# Altium schematic sheet STM32.SchDoc: STM32
size A3; Author: Silvio Navaretti; CompanyName: ARDUINO; DrawnBy: Silvio Navaretti; Engineer: Silvio Navaretti; Organization: ARDUINO; SheetNumber: 12; SheetTotal: 51; RevAuthor: Silvio Navaretti
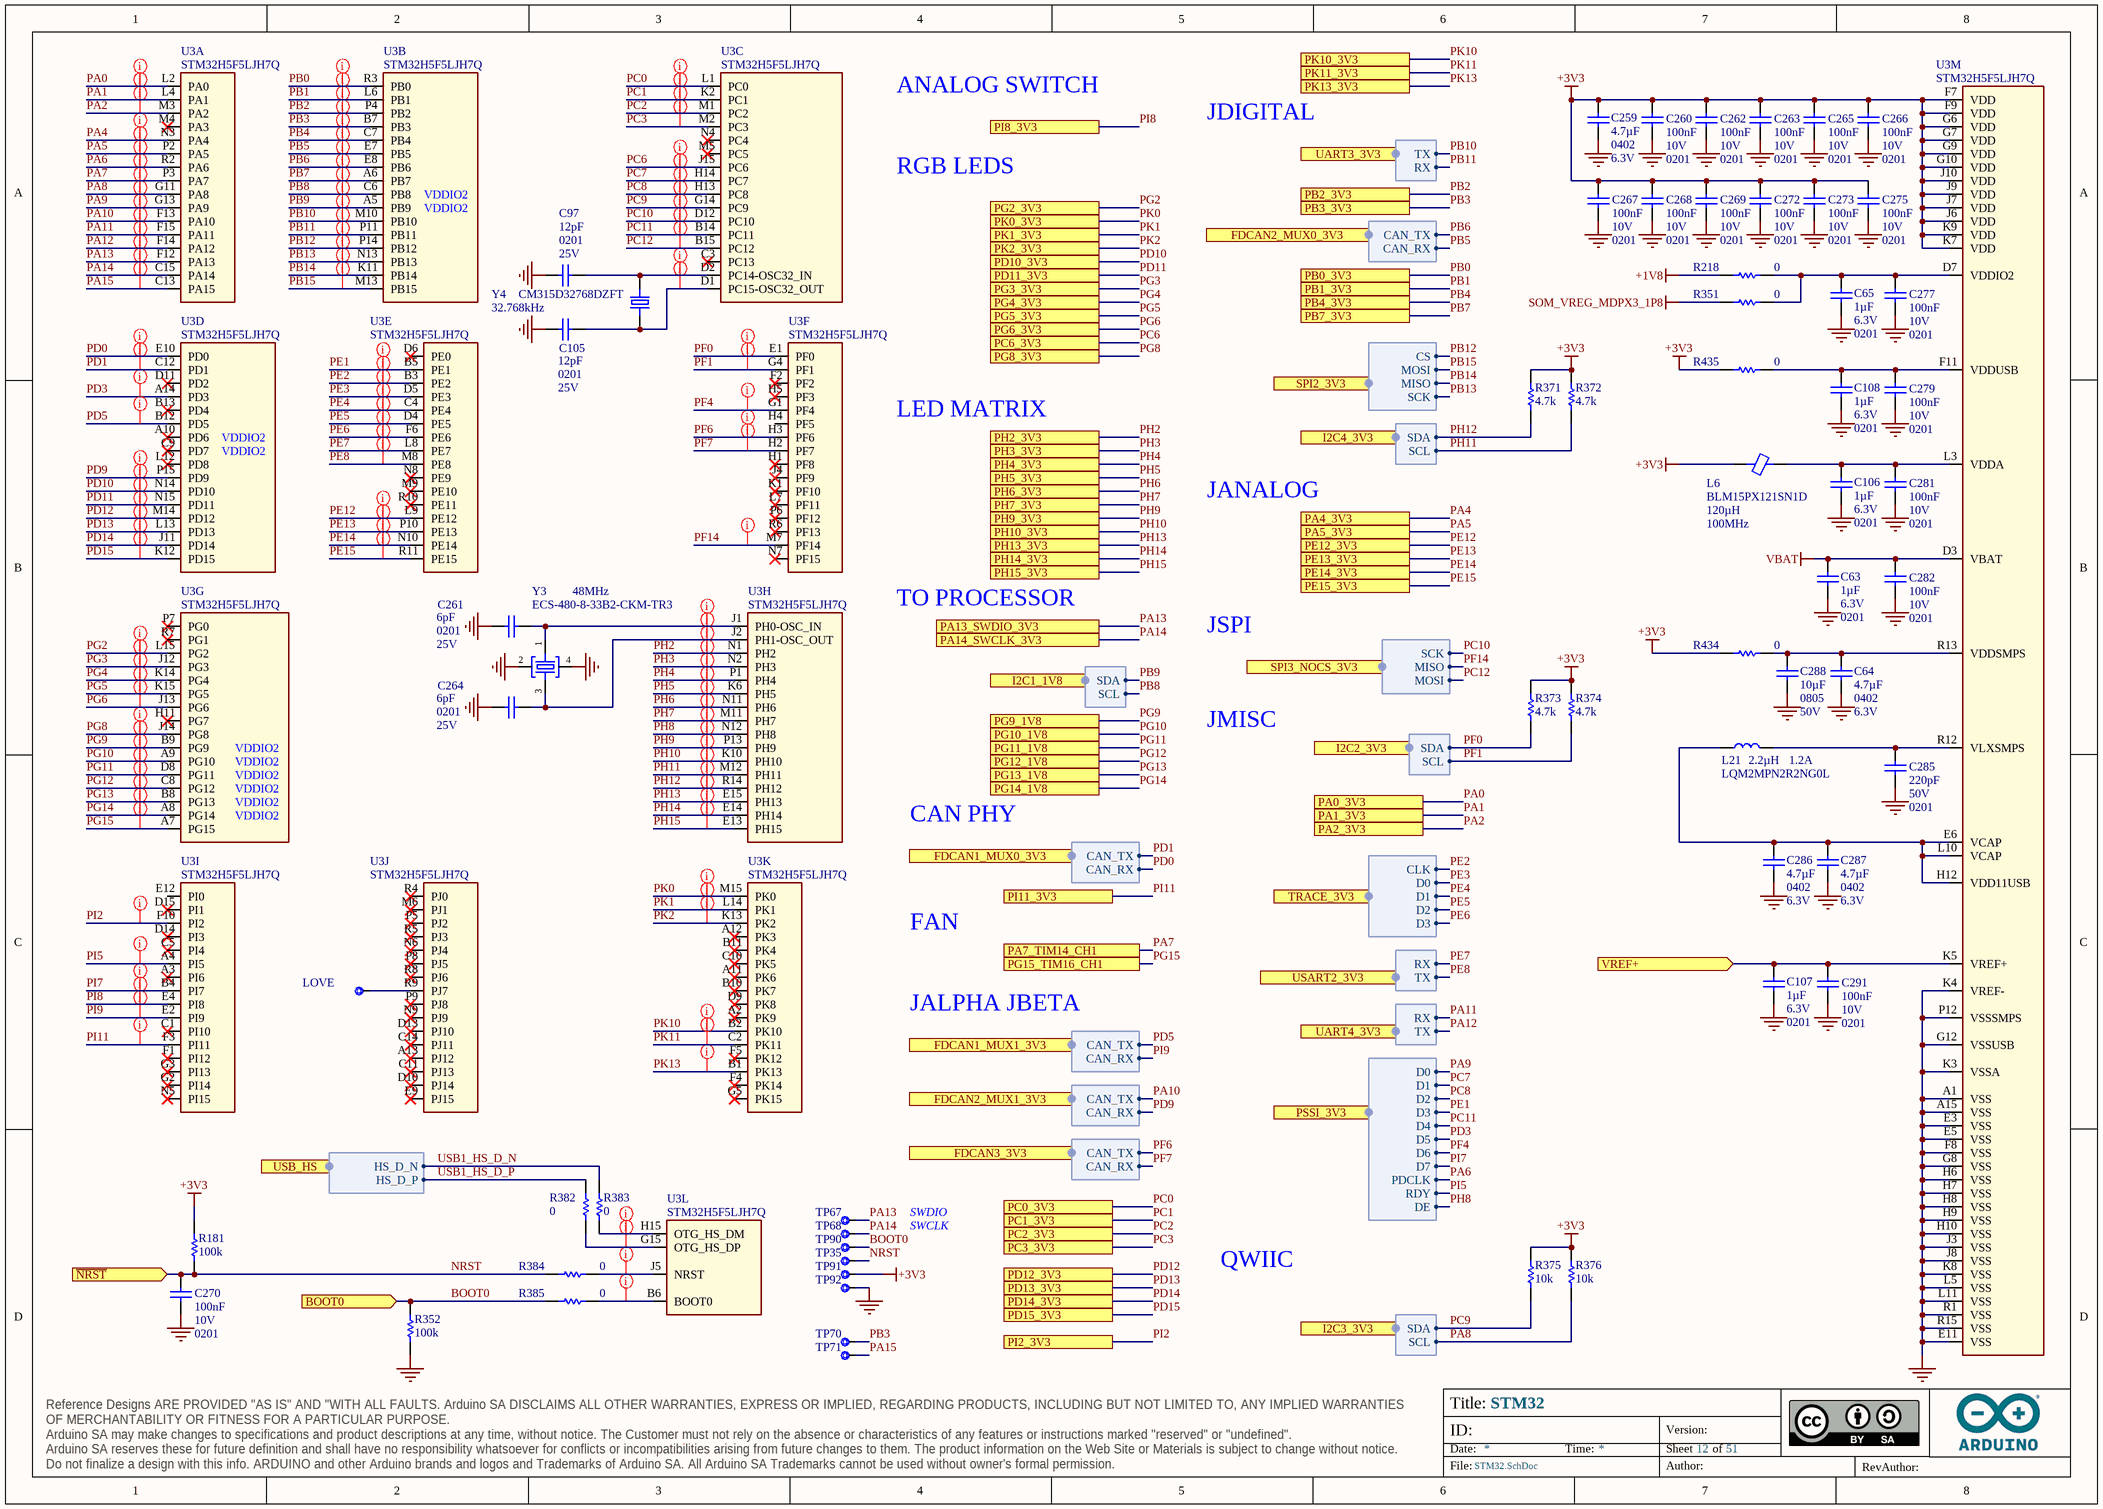
[diagram p0: STM32.SchDoc]

## Parts
C63  value 1µF  Voltage: 6.3V  Case Code (Imperial): 0201  [CAP-0201]  (hidden comment: GRM033R60J105MEA2D)
C64  value 4.7µF  Case Code (Imperial): 0402  Voltage: 6.3V  [CAP-0402]  (hidden comment: C1005A475M6R3NT)
C65  value 1µF  Voltage: 6.3V  Case Code (Imperial): 0201  [CAP-0201]  (hidden comment: GRM033R60J105MEA2D)
C97  value 12pF  Case Code (Imperial): 0201  Voltage: 25V  [CAP-0201]  (hidden comment: GRM0335C1E120JA01J)
C105  value 12pF  Case Code (Imperial): 0201  Voltage: 25V  [CAP-0201]  (hidden comment: GRM0335C1E120JA01J)
C106  value 1µF  Voltage: 6.3V  Case Code (Imperial): 0201  [CAP-0201]  (hidden comment: GRM033R60J105MEA2D)
C107  value 1µF  Voltage: 6.3V  Case Code (Imperial): 0201  [CAP-0201]  (hidden comment: GRM033R60J105MEA2D)
C108  value 1µF  Voltage: 6.3V  Case Code (Imperial): 0201  [CAP-0201]  (hidden comment: GRM033R60J105MEA2D)
C259  value 4.7µF  Case Code (Imperial): 0402  Voltage: 6.3V  [CAP-0402]  (hidden comment: C1005A475M6R3NT)
C260  value 100nF  Voltage: 10V  Case Code (Imperial): 0201  [CAP-0201]  (hidden comment: CL03A104KP3NNNC)
C261  value 6pF  Case Code (Imperial): 0201  Voltage: 25V  [CAP-0201]  (hidden comment: GRM0335C1E6R0CA01D)
C262  value 100nF  Voltage: 10V  Case Code (Imperial): 0201  [CAP-0201]  (hidden comment: CL03A104KP3NNNC)
C263  value 100nF  Voltage: 10V  Case Code (Imperial): 0201  [CAP-0201]  (hidden comment: CL03A104KP3NNNC)
C264  value 6pF  Case Code (Imperial): 0201  Voltage: 25V  [CAP-0201]  (hidden comment: GRM0335C1E6R0CA01D)
C265  value 100nF  Voltage: 10V  Case Code (Imperial): 0201  [CAP-0201]  (hidden comment: CL03A104KP3NNNC)
C266  value 100nF  Voltage: 10V  Case Code (Imperial): 0201  [CAP-0201]  (hidden comment: CL03A104KP3NNNC)
C267  value 100nF  Voltage: 10V  Case Code (Imperial): 0201  [CAP-0201]  (hidden comment: CL03A104KP3NNNC)
C268  value 100nF  Voltage: 10V  Case Code (Imperial): 0201  [CAP-0201]  (hidden comment: CL03A104KP3NNNC)
C269  value 100nF  Voltage: 10V  Case Code (Imperial): 0201  [CAP-0201]  (hidden comment: CL03A104KP3NNNC)
C270  value 100nF  Voltage: 10V  Case Code (Imperial): 0201  [CAP-0201]  (hidden comment: CL03A104KP3NNNC)
C272  value 100nF  Voltage: 10V  Case Code (Imperial): 0201  [CAP-0201]  (hidden comment: CL03A104KP3NNNC)
C273  value 100nF  Voltage: 10V  Case Code (Imperial): 0201  [CAP-0201]  (hidden comment: CL03A104KP3NNNC)
C275  value 100nF  Voltage: 10V  Case Code (Imperial): 0201  [CAP-0201]  (hidden comment: CL03A104KP3NNNC)
C277  value 100nF  Voltage: 10V  Case Code (Imperial): 0201  [CAP-0201]  (hidden comment: CL03A104KP3NNNC)
C279  value 100nF  Voltage: 10V  Case Code (Imperial): 0201  [CAP-0201]  (hidden comment: CL03A104KP3NNNC)
C281  value 100nF  Voltage: 10V  Case Code (Imperial): 0201  [CAP-0201]  (hidden comment: CL03A104KP3NNNC)
C282  value 100nF  Voltage: 10V  Case Code (Imperial): 0201  [CAP-0201]  (hidden comment: CL03A104KP3NNNC)
C285  value 220pF  Voltage: 50V  Case Code (Imperial): 0201  [CAP-0201]  (hidden comment: GRM033R71H221KA12D)
C286  value 4.7µF  Case Code (Imperial): 0402  Voltage: 6.3V  [CAP-0402]  (hidden comment: C1005A475M6R3NT)
C287  value 4.7µF  Case Code (Imperial): 0402  Voltage: 6.3V  [CAP-0402]  (hidden comment: C1005A475M6R3NT)
C288  value 10µF  Case Code (Imperial): 0805  Voltage: 50V  [CAP-0805]  (hidden comment: GRM21BR61H106ME43L)
C291  value 100nF  Voltage: 10V  Case Code (Imperial): 0201  [CAP-0201]  (hidden comment: CL03A104KP3NNNC)
L6  BLM15PX121SN1D  Inductance: 120µH  Test Frequency: 100MHz  [L-0402]
L21  LQM2MPN2R2NG0L  Current: 1.2A  Inductance: 2.2µH  [LQM2MPN2R2NG0L]
LOVE  Test point 1.00mm  [TP-1.00MM]  (value not drawn)  (no BOM)
R181  value 100k  [RES-0201]  (hidden comment: RC0201FR-07100KL)
R218  value 0  [RES-0201]  (hidden comment: CRCW02010000Z0ED)
R351  value 0  [RES-0201]  (hidden comment: CRCW02010000Z0ED)
R352  value 100k  [RES-0201]  (hidden comment: RC0201FR-07100KL)
R371  value 4.7k  [RES-0201]  (hidden comment: RC0201FR-074K7L)
R372  value 4.7k  [RES-0201]  (hidden comment: RC0201FR-074K7L)
R373  value 4.7k  [RES-0201]  (hidden comment: RC0201FR-074K7L)
R374  value 4.7k  [RES-0201]  (hidden comment: RC0201FR-074K7L)
R375  value 10k  [RES-0201]  (hidden comment: RC0201FR-0710KL)
R376  value 10k  [RES-0201]  (hidden comment: RC0201FR-0710KL)
R382  value 0  [RES-0201]  (hidden comment: CRCW02010000Z0ED)
R383  value 0  [RES-0201]  (hidden comment: CRCW02010000Z0ED)
R384  value 0  [RES-0201]  (hidden comment: CRCW02010000Z0ED)
R385  value 0  [RES-0201]  (hidden comment: CRCW02010000Z0ED)
R434  value 0  [RES-0201]  (hidden comment: CRCW02010000Z0ED)
R435  value 0  [RES-0201]  (hidden comment: CRCW02010000Z0ED)
TP35  Test point 1.00mm  [TP-1.00MM]  (value not drawn)  (no BOM)
TP67  Test point 1.00mm  [TP-1.00MM]  (value not drawn)  (no BOM)
TP68  Test point 1.00mm  [TP-1.00MM]  (value not drawn)  (no BOM)
TP70  Test point 1.00mm  [TP-1.00MM]  (value not drawn)  (no BOM)
TP71  Test point 1.00mm  [TP-1.00MM]  (value not drawn)  (no BOM)
TP90  Test point 1.00mm  [TP-1.00MM]  (value not drawn)  (no BOM)
TP91  Test point 1.00mm  [TP-1.00MM]  (value not drawn)  (no BOM)
TP92  Test point 1.00mm  [TP-1.00MM]  (value not drawn)  (no BOM)
U3  STM32H5F5LJH7Q  [BGA225C80P15X15_1300X1300X120]  (parts A,B,C,D,E,F,G,H,I,J,K,L,M of 13)
Y3  ECS-480-8-33B2-CKM-TR3  Frequency: 48MHz  [CRYSTAL3.2X2.5]
Y4  CM315D32768DZFT  Frequency: 32.768kHz  [ABS07]

## Ports
BOOT0 (in), FDCAN1_MUX0_3V3 (harness CAN), FDCAN1_MUX1_3V3 (harness CAN), FDCAN2_MUX0_3V3 (harness CAN), FDCAN2_MUX1_3V3 (harness CAN), FDCAN3_3V3 (harness CAN), I2C1_1V8 (harness I2C), I2C2_3V3 (harness I2C), I2C3_3V3 (harness I2C), I2C4_3V3 (harness I2C), PA0_3V3, PA1_3V3, PA2_3V3, PA4_3V3, PA5_3V3, PA7_TIM14_CH1, PA13_SWDIO_3V3, PA14_SWCLK_3V3, PB0_3V3, PB1_3V3, PB2_3V3, PB3_3V3, PB4_3V3, PB7_3V3, PC0_3V3, PC1_3V3, PC2_3V3, PC3_3V3, PC6_3V3, PD10_3V3, PD11_3V3, PD12_3V3, PD13_3V3, PD14_3V3, PD15_3V3, PE12_3V3, PE13_3V3, PE14_3V3, PE15_3V3, PG2_3V3, PG3_3V3, PG4_3V3, PG5_3V3, PG6_3V3, PG8_3V3, PG9_1V8, PG10_1V8, PG11_1V8, PG12_1V8, PG13_1V8, PG14_1V8, PG15_TIM16_CH1, PH2_3V3, PH3_3V3, PH4_3V3, PH5_3V3, PH6_3V3, PH7_3V3, PH9_3V3, PH10_3V3, PH13_3V3, PH14_3V3, PH15_3V3, PI2_3V3, PI8_3V3, PI11_3V3, PK0_3V3, PK1_3V3, PK2_3V3, PK10_3V3, PK11_3V3, PK13_3V3, PSSI_3V3 (harness PSSI), SPI2_3V3 (harness SPI), SPI3_NOCS_3V3 (harness JSPI_SPI), TRACE_3V3 (harness MCU_TRACE), UART3_3V3 (harness UART), UART4_3V3 (harness UART), USART2_3V3 (harness UART), USB_HS (harness SOM_MD_USB1), VREF+ (in), ~{NRST} (in)

## Harnesses
SPI: SCK, MISO, MOSI, CS
UART: TX, RX
I2C: SDA, SCL
CAN: CAN_TX, CAN_RX
PSSI: D0, D1, D2, D3, D4, D5, D6, D7, PDCLK, RDY, DE
JSPI_SPI: SCK, MISO, MOSI
MCU_TRACE: CLK, D0, D1, D2, D3
SOM_MD_USB1: HS_D_P, HS_D_N

## Nets
+1V8: R218.1
+3V3: C259.1 C260.2 C262.2 C263.2 C265.2 C266.2 C267.2 C268.2 C269.2 C272.2 C273.2 C275.2 L6.1 R181.2 R371.2 R372.2 R373.2 R374.2 R375.2 R376.2 R434.1 R435.1 TP91.X U3.F7(VDD) U3.F9(VDD) U3.G6(VDD) U3.G7(VDD) U3.G9(VDD) U3.G10(VDD) U3.J6(VDD) U3.J7(VDD) U3.J9(VDD) U3.J10(VDD) U3.K7(VDD) U3.K9(VDD)
GND: C63.1 C64.2 C65.1 C97.2 C105.2 C106.1 C107.1 C108.1 C259.2 C260.1 C261.2 C262.1 C263.1 C264.2 C265.1 C266.1 C267.1 C268.1 C269.1 C270.1 C272.1 C273.1 C275.1 C277.1 C279.1 C281.1 C282.1 C285.1 C286.2 C287.2 C288.2 C291.1 R352.1 TP92.X U3.A1(VSS) U3.A15(VSS) U3.E3(VSS) U3.E5(VSS) U3.E11(VSS) U3.F8(VSS) U3.G8(VSS) U3.G12(VSSUSB) U3.H6(VSS) U3.H7(VSS) U3.H8(VSS) U3.H9(VSS) U3.H10(VSS) U3.J3(VSS) U3.J8(VSS) U3.K3(VSSA) U3.K4(VREF-) U3.K8(VSS) U3.L5(VSS) U3.L11(VSS) U3.P12(VSSSMPS) U3.R1(VSS) U3.R15(VSS) Y3.2 Y3.4
SOM_VREG_MDPX3_1P8: R351.1
VBAT: C63.2 C282.2 U3.D3(VBAT)
BOOT0: R352.2 R385.1 TP90.X ; port BOOT0
NRST: C270.2 R181.1 R384.1 TP35.X ; port ~{NRST}
PA0: U3.L2(PA0) ; port PA0_3V3
PA1: U3.L4(PA1) ; port PA1_3V3
PA2: U3.M3(PA2) ; port PA2_3V3
PA4: U3.N3(PA4) ; port PA4_3V3
PA5: U3.P2(PA5) ; port PA5_3V3
PA6: U3.R2(PA6) ; port PSSI_3V3.PDCLK
PA7: U3.P3(PA7) ; port PA7_TIM14_CH1
PA8: R376.1 U3.G11(PA8) ; port I2C3_3V3.SCL
PA9: U3.G13(PA9) ; port PSSI_3V3.D0
PA10: U3.F13(PA10) ; port FDCAN2_MUX1_3V3.CAN_TX
PA11: U3.F15(PA11) ; port UART4_3V3.RX
PA12: U3.F14(PA12) ; port UART4_3V3.TX
PA13: TP67.X U3.F12(PA13) ; port PA13_SWDIO_3V3
PA14: TP68.X U3.C15(PA14) ; port PA14_SWCLK_3V3
PA15: TP71.X U3.C13(PA15)
PB0: U3.R3(PB0) ; port PB0_3V3
PB1: U3.L6(PB1) ; port PB1_3V3
PB2: U3.P4(PB2) ; port PB2_3V3
PB3: TP70.X U3.B7(PB3) ; port PB3_3V3
PB4: U3.C7(PB4) ; port PB4_3V3
PB5: U3.E7(PB5) ; port FDCAN2_MUX0_3V3.CAN_RX
PB6: U3.E8(PB6) ; port FDCAN2_MUX0_3V3.CAN_TX
PB7: U3.A6(PB7) ; port PB7_3V3
PB8: U3.C6(PB8) ; port I2C1_1V8.SCL
PB9: U3.A5(PB9) ; port I2C1_1V8.SDA
PB10: U3.M10(PB10) ; port UART3_3V3.TX
PB11: U3.P11(PB11) ; port UART3_3V3.RX
PB12: U3.P14(PB12) ; port SPI2_3V3.CS
PB13: U3.N13(PB13) ; port SPI2_3V3.SCK
PB14: U3.K11(PB14) ; port SPI2_3V3.MISO
PB15: U3.M13(PB15) ; port SPI2_3V3.MOSI
PC0: U3.L1(PC0) ; port PC0_3V3
PC1: U3.K2(PC1) ; port PC1_3V3
PC2: U3.M1(PC2) ; port PC2_3V3
PC3: U3.M2(PC3) ; port PC3_3V3
PC6: U3.J15(PC6) ; port PC6_3V3
PC7: U3.H14(PC7) ; port PSSI_3V3.D1
PC8: U3.H13(PC8) ; port PSSI_3V3.D2
PC9: R375.1 U3.G14(PC9) ; port I2C3_3V3.SDA
PC10: U3.D12(PC10) ; port SPI3_NOCS_3V3.SCK
PC11: U3.B14(PC11) ; port PSSI_3V3.D4
PC12: U3.B15(PC12) ; port SPI3_NOCS_3V3.MOSI
PD0: U3.E10(PD0) ; port FDCAN1_MUX0_3V3.CAN_RX
PD1: U3.C12(PD1) ; port FDCAN1_MUX0_3V3.CAN_TX
PD3: U3.A14(PD3) ; port PSSI_3V3.D5
PD5: U3.B12(PD5) ; port FDCAN1_MUX1_3V3.CAN_TX
PD9: U3.P15(PD9) ; port FDCAN2_MUX1_3V3.CAN_RX
PD10: U3.N14(PD10) ; port PD10_3V3
PD11: U3.N15(PD11) ; port PD11_3V3
PD12: U3.M14(PD12) ; port PD12_3V3
PD13: U3.L13(PD13) ; port PD13_3V3
PD14: U3.J11(PD14) ; port PD14_3V3
PD15: U3.K12(PD15) ; port PD15_3V3
PE1: U3.B5(PE1) ; port PSSI_3V3.D3
PE2: U3.B3(PE2) ; port TRACE_3V3.CLK
PE3: U3.D5(PE3) ; port TRACE_3V3.D0
PE4: U3.C4(PE4) ; port TRACE_3V3.D1
PE5: U3.D4(PE5) ; port TRACE_3V3.D2
PE6: U3.F6(PE6) ; port TRACE_3V3.D3
PE7: U3.L8(PE7) ; port USART2_3V3.RX
PE8: U3.M8(PE8) ; port USART2_3V3.TX
PE12: U3.L9(PE12) ; port PE12_3V3
PE13: U3.P10(PE13) ; port PE13_3V3
PE14: U3.N10(PE14) ; port PE14_3V3
PE15: U3.R11(PE15) ; port PE15_3V3
PF0: R373.1 U3.E1(PF0) ; port I2C2_3V3.SDA
PF1: R374.1 U3.G4(PF1) ; port I2C2_3V3.SCL
PF4: U3.G1(PF4) ; port PSSI_3V3.D6
PF6: U3.H3(PF6) ; port FDCAN3_3V3.CAN_TX
PF7: U3.H2(PF7) ; port FDCAN3_3V3.CAN_RX
PF14: U3.M7(PF14) ; port SPI3_NOCS_3V3.MISO
PG2: U3.L15(PG2) ; port PG2_3V3
PG3: U3.J12(PG3) ; port PG3_3V3
PG4: U3.K14(PG4) ; port PG4_3V3
PG5: U3.K15(PG5) ; port PG5_3V3
PG6: U3.J13(PG6) ; port PG6_3V3
PG8: U3.J14(PG8) ; port PG8_3V3
PG9: U3.B9(PG9) ; port PG9_1V8
PG10: U3.A9(PG10) ; port PG10_1V8
PG11: U3.D8(PG11) ; port PG11_1V8
PG12: U3.C8(PG12) ; port PG12_1V8
PG13: U3.B8(PG13) ; port PG13_1V8
PG14: U3.A8(PG14) ; port PG14_1V8
PG15: U3.A7(PG15) ; port PG15_TIM16_CH1
PH2: U3.N1(PH2) ; port PH2_3V3
PH3: U3.N2(PH3) ; port PH3_3V3
PH4: U3.P1(PH4) ; port PH4_3V3
PH5: U3.K6(PH5) ; port PH5_3V3
PH6: U3.N11(PH6) ; port PH6_3V3
PH7: U3.M11(PH7) ; port PH7_3V3
PH8: U3.N12(PH8) ; port PSSI_3V3.DE
PH9: U3.P13(PH9) ; port PH9_3V3
PH10: U3.K10(PH10) ; port PH10_3V3
PH11: R372.1 U3.M12(PH11) ; port I2C4_3V3.SCL
PH12: R371.1 U3.R14(PH12) ; port I2C4_3V3.SDA
PH13: U3.E15(PH13) ; port PH13_3V3
PH14: U3.E14(PH14) ; port PH14_3V3
PH15: U3.E13(PH15) ; port PH15_3V3
PI2: U3.F10(PI2) ; port PI2_3V3
PI5: U3.A4(PI5) ; port PSSI_3V3.RDY
PI7: U3.B4(PI7) ; port PSSI_3V3.D7
PI8: U3.E4(PI8) ; port PI8_3V3
PI9: U3.E2(PI9) ; port FDCAN1_MUX1_3V3.CAN_RX
PI11: U3.F3(PI11) ; port PI11_3V3
PK0: U3.M15(PK0) ; port PK0_3V3
PK1: U3.L14(PK1) ; port PK1_3V3
PK2: U3.K13(PK2) ; port PK2_3V3
PK10: U3.B2(PK10) ; port PK10_3V3
PK11: U3.C2(PK11) ; port PK11_3V3
PK13: U3.B1(PK13) ; port PK13_3V3
USB1_HS_D_N: R383.1 ; port USB_HS.HS_D_N
USB1_HS_D_P: R382.1 ; port USB_HS.HS_D_P
VREF+: C107.2 C291.2 U3.K5(VREF+) ; port VREF+
NetC64_1: C64.1 C288.1 R434.2 U3.R13(VDDSMPS)
NetC65_2: C65.2 C277.2 R218.2 R351.2 U3.D7(VDDIO2)
NetC97_1: C97.1 U3.D2(PC14-OSC32_IN) Y4.2
NetC105_1: C105.1 U3.D1(PC15-OSC32_OUT) Y4.1
NetC106_2: C106.2 C281.2 L6.2 U3.L3(VDDA)
NetC108_2: C108.2 C279.2 R435.2 U3.F11(VDDUSB)
NetC261_1: C261.1 U3.J1(PH0-OSC_IN) Y3.1
NetC264_1: C264.1 U3.J2(PH1-OSC_OUT) Y3.3
NetC285_2: C285.2 L21.2 U3.R12(VLXSMPS)
NetC286_1: C286.1 C287.1 L21.1 U3.E6(VCAP) U3.H12(VDD11USB) U3.L10(VCAP)
NetLOVE_X: LOVE.X U3.R9(PJ7)
NetR382_2: R382.2 U3.G15(OTG_HS_DP)
NetR383_2: R383.2 U3.H15(OTG_HS_DM)
NetR384_2: R384.2 U3.J5(NRST)
NetR385_2: R385.2 U3.B6(BOOT0)

Not connected (* = marked no-connect by the designer): U3 A2(PK9)* A3(PI6)* A10(PD6)* A11(PK6)* A12(PK3)* A13(PJ12)* B10(PK7)* B11(PK4)* B13(PD4)* C1(PI10)* C3(PC13)* C5(PI4)* C9(PD7)* C10(PK5)* C11(PJ13)* C14(PJ11)* D6(PE0)* D9(PK8)* D10(PJ14)* D11(PD2)* D13(PJ10)* D14(PI3)* D15(PI1)* E9(PJ15)* E12(PI0) F1(PI12)* F2(PF2)* F4(PK14)* F5(PK12)* G2(PI14)* G3(PI13)* G5(PK15)* H1(PF8)* H4(PF5) H5(PF3)* H11(PG7)* J4(PF9)* K1(PF10)* L7(PF11)* L12(PD8)* M4(PA3)* M5(PC5)* M6(PJ1)* M9(PE10)* N4(PC4)* N5(PI15)* N6(PJ4)* N7(PF15)* N8(PE9)* N9(PJ9)* P5(PJ2)* P6(PF12)* P7(PG0)* P8(PJ5)* P9(PJ8)* R4(PJ0)* R5(PJ3)* R6(PF13)* R7(PG1)* R8(PJ6)* R10(PE11)*

## Layout directives
net class MICROCONTROLLER: NetC97_1, NetC105_1, NetC261_1, NetC264_1, NetR382_2, NetR383_2, NetR384_2, NetR385_2, PA0, PA1, PA2, PA4, PA5, PA6, PA7, PA8, PA9, PA10, PA11, PA12, PA13, PA14, PA15, PB0, PB1, PB2, PB3, PB4, PB5, PB6, PB7, PB8, PB9, PB10, PB11, PB12, PB13, PB14, PB15, PC0, PC1, PC2, PC3, PC6, PC7, PC8, PC9, PC10, PC11, PC12, PD0, PD1, PD3, PD5, PD9, PD10, PD11, PD12, PD13, PD14, PD15, PE1, PE2, PE3, PE4, PE5, PE6, PE7, PE8, PE12, PE13, PE14, PE15, PF0, PF1, PF4, PF6, PF7, PF14, PG2, PG3, PG4, PG5, PG6, PG8, PG9, PG10, PG11, PG12, PG13, PG14, PG15, PH2, PH3, PH4, PH5, PH6, PH7, PH8, PH9, PH10, PH11, PH12, PH13, PH14, PH15, PI2, PI5, PI7, PI8, PI9, PI11, PK0, PK1, PK2, PK10, PK11, PK13

## Notes on the sheet
- ANALOG SWITCH
- RGB LEDS
- JDIGITAL
- LED MATRIX
- JANALOG
- TO PROCESSOR
- JSPI
- JMISC
- CAN PHY
- FAN
- JALPHA JBETA
- SWDIO
- SWCLK
- QWIIC
- Title:
- ID:
- Date:
- Time:
- Version:
- Sheet
- of
- RevAuthor:
- Reference Designs ARE PROVIDED "AS IS" AND "WITH ALL FAULTS. Arduino SA DISCLAIMS ALL OTHER WARRANTIES, EXPRESS OR IMPLIED, REGARDING PRODUCTS, INCLUDING BUT NOT LIMITED TO, ANY IMPLIED WARRANTIES OF MERCHANTABILITY OR FITNESS FOR A PARTICULAR PURPOSE.
  Arduino SA may make changes to specifications and product descriptions at any time, without notice. The Customer must not rely on the absence or characteristics of any features or instructions marked "reserved" or "undefined".
  Arduino SA reserves these for future definition and shall have no responsibility whatsoever for conflicts or incompatibilities arising from future changes to them. The product information on the Web Site or Materials is subject to change without notice.
  Do not finalize a design with this info. ARDUINO and other Arduino brands and logos and Trademarks of Arduino SA. All Arduino SA Trademarks cannot be used without owner's formal permission.
- File:
- Author:

## Library data of the parts
C63 C65 C106-C108 = C0002-A.15: CAP CHIP 0201 1uF 20% 6.3V X5R; Manufacturer: Murata; Code Arduino: A5520; Tolerance: 20%; Dielectric: X5R; Part Number: GRM033R60J105MEA2D; Technology: Ceramic
C64 C259 C286 C287 = C0037-A.14: CAP CHIP 0402 4.7uF 20% 6V3 X5R; Manufacturer: Hottech; Code Arduino: 0833; Dielectric: X5R; Technology: Ceramic; Part Number: C1005A475M6R3NT; Manufacturer 2: Samsung Electro-Mechanics; Tolerance: 20%; Manufacturer 3: Murata Electronics; Part number 3: GRM155R60J475ME47D; Part number 2: CL05A475KQ5NRNC
C97 C105 = C0003-A.15: CAP CHIP 0201 12pF 5% 25V C0G; Manufacturer: Murata; Code Arduino: C0003; Technology: Ceramic; Part Number: GRM0335C1E120JA01J; Tolerance: 5%; Dielectric: C0G
C260 C262 C263 C265-C270 C272 C273 C275 C277 C279 C281 C282 C291 = C0113-A.6: CAP CHIP 0201 100nF 10% 10V X5R; Manufacturer: Samsung Electro-Mechanics; Code Arduino: C0113; Technology: Ceramic; Part Number: CL03A104KP3NNNC; Dielectric: X5R; Tolerance: 10%
C261 C264 = C0203-A.1: CAP CHIP 0201 6pF 0.25pF 25V C0G; Manufacturer: Murata; Code Arduino: C0203; Technology: Ceramic; Part Number: GRM0335C1E6R0CA01D; Tolerance: 0.25pF; Dielectric: C0G
C285 = C0202-A.1: CAP CHIP 0201 220pF 10% 50V X7R; Manufacturer: Murata; Code Arduino: C0202; Technology: Ceramic; Part Number: GRM033R71H221KA12D; Dielectric: X7R; Tolerance: 10%
C288 = C0158-A.3: CAP CHIP 0805 10uF 20% 50V X5R; Manufacturer: Murata Electronics; Code Arduino: C0158; Tolerance: 20%; Dielectric: X5R; Technology: SMD; Part Number: GRM21BR61H106ME43L
L6 = I0028-A.10: FERRITE SMD 0402 120Ohm 25% 100MHz Ferrite 2A; Manufacturer: Murata; DC Resistance (DCR): 55mR; Code Arduino: I0028; Value: 120µH; Device Type: Ferrite; Packaging: Tape and Reel; Case Code (Imperial): 0402; Max DC Current: 2A; Case Code (Metric): 1005; Package Quantity: 10000; Current: 2A; Max Operating Temperature: 125°C; Tolerance: 25%; Min Operating Temperature: -55°C; Part Number: BLM15PX121SN1D
L21 = I0019-A.10: INDUCTOR SMD 0806 2.2uH 1.2A; Manufacturer: Murata; DC Resistance (DCR): 138mR; Tolerance: 30%; Test Frequency: 1MHz; Code Arduino: A5528; Case Code (Imperial): 0806; Package Quantity: 1; Part Number: LQM2MPN2R2NG0L; Case Code (Metric): 2016; Device Type: Inductor; Min Operating Temperature: -55°C; Packaging: Tape and Reel; Max DC Current: 1.2A; Max Operating Temperature: 125°C
LOVE = UT0013-A.6: Manufacturer: This is not a component; Source: ut.SchLib; Design Item ID: CMP-018-0005-A.3; Pin Count: 1; Part Number: This is not a component; Code Arduino: This is not a component
R181 R352 = R0146-A.21: RES CHIP 0201 100k 1% 1/20W; Manufacturer: Yageo; Power: 50mW; Temperature coefficient: 200ppm; Code Arduino: R0146; Manufacturer 2: Samsung Electro-Mechanics; Tolerance: 1%; Case Code (Imperial): 0201; Part Number: RC0201FR-07100KL; Technology: Thick film
R218 R351 R382-R385 R434 R435 = R0140-A.21: RES CHIP 0201 0R; Manufacturer: Vishay; Temperature coefficient: 0ppm; Code Arduino: R0140; Power: 50mW; Tolerance: 0%; Technology: Thick film; Case Code (Imperial): 0201; Part Number: CRCW02010000Z0ED
R371-R374 = R0151-A.21: RES CHIP 0201 4k7 1% 1/20W; Manufacturer: Yageo; Power: 50mW; Temperature coefficient: 200ppm; Code Arduino: A5521; Tolerance: 1%; Case Code (Imperial): 0201; Part Number: RC0201FR-074K7L; Technology: Thick film
R375 R376 = R0145-A.21: RES CHIP 0201 10k 1% 1/20W; Manufacturer: Yageo; Power: 50mW; Temperature coefficient: 200ppm; Code Arduino: R0145; Manufacturer 2: Samsung Electro-Mechanics; Tolerance: 1%; Case Code (Imperial): 0201; Part Number: RC0201FR-0710KL; Technology: Thick film
TP35 TP67 TP68 TP70 TP71 TP90-TP92 = UT0013-A.6: Part Number: This is not a component; Design Item ID: CMP-018-0005-A.3; Source: ut.SchLib; Manufacturer: This is not a component; Code Arduino: This is not a component; Pin Count: 1
U3 = U0520-A.5: IC Cortex M33 250MHz, 4MB flash, 1.5MB RAM, TFBGA225 13x13mm; Manufacturer: ST; Code Arduino: U0520; Part Number: STM32H5F5LJH7Q
Y3 = X0035-A.2: CRYSTAL 48MHz tolerance 10ppm stability 15ppm load 10pF, shunt 2pF, ESR 30R, 3.2x2.5mm; Manufacturer: ECS; Load Capacitance: 8pF; ESR (Equivalent Series Resistance): 30; Code Arduino: X0035; Frequency Tolerance: 10ppm; Series Resistance: 30R; Frequency Stability: 15ppm; Part Number: ECS-480-8-33B2-CKM-TR3
Y4 = X0003-A.5: CRYSTAL 32.768kHz 20ppm 12.5pF SMD 1.6x0.9mm; Manufacturer: Citizen FineDevice; Frequency Stability: 0.12%; Code Arduino: 0213; Series Resistance: 70kR; Max Operating Temperature: 85°C; Load Capacitance: 12.5pF; Radiation Hardening: No; Frequency Tolerance: 20ppm; Min Operating Temperature: -40°C; Part Number: CM315D32768DZFT